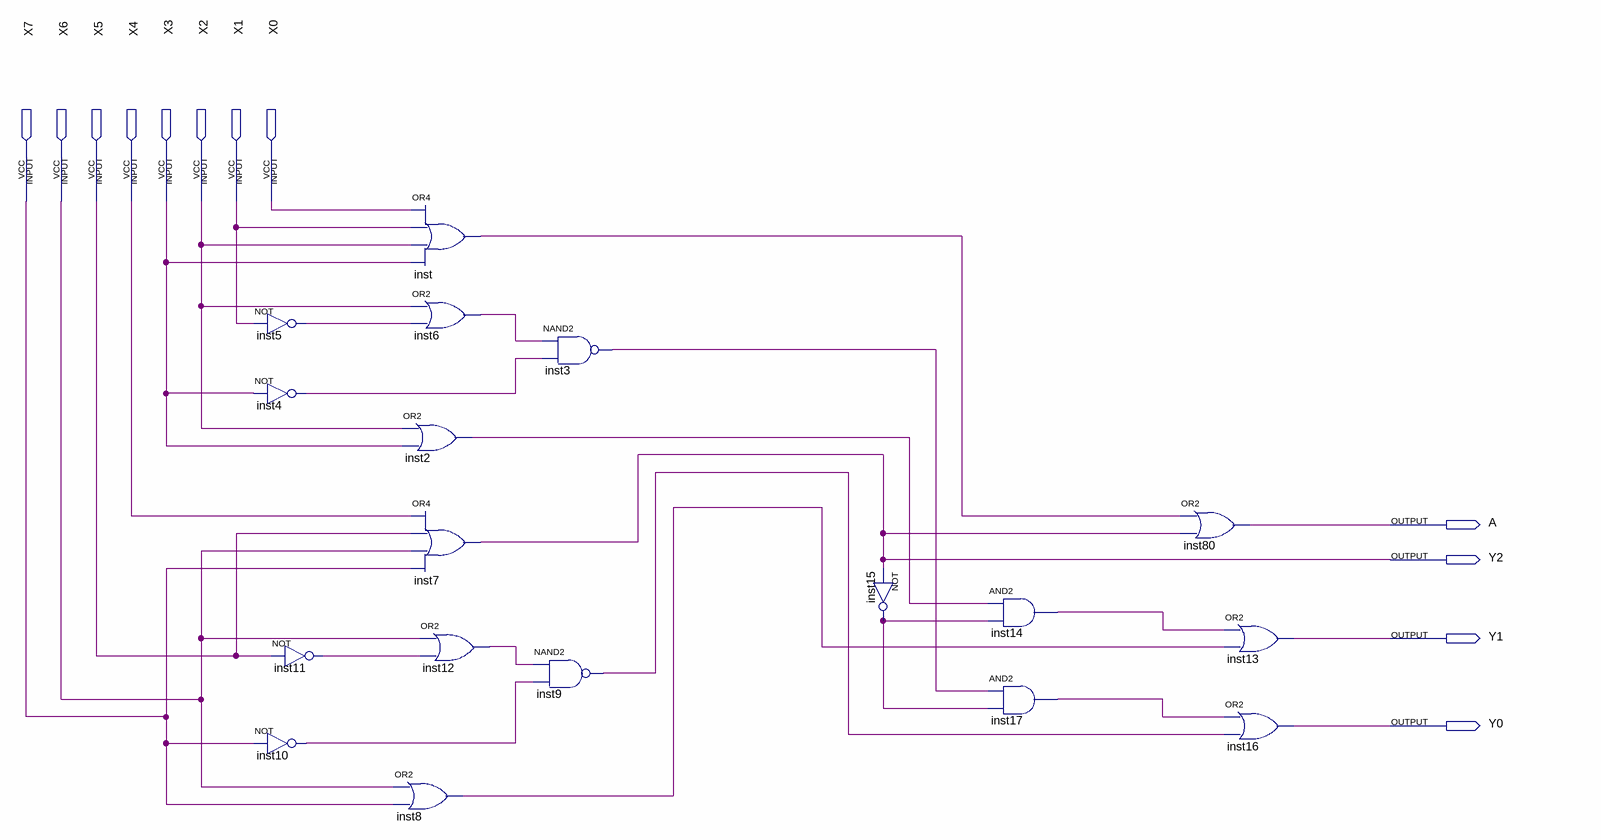
[diagram p0: schematic sheet]
// Quartus schematic q51.bdf as structural Verilog: 18 symbols, 12 pins
module q51 (
  input  X7,
  input  X6,
  input  X5,
  input  X4,
  input  X3,
  input  X2,
  input  X1,
  input  X0,
  output A,
  output Y2,
  output Y1,
  output Y0
);

  wire inst2_out, inst3_out, inst4_out, inst5_out, inst6_out, inst8_out, inst9_out, inst10_out, inst11_out,
       inst12_out, inst14_out, inst15_out, inst17_out, inst_out;

  not inst5 (inst5_out, X1);
  not inst4 (inst4_out, X3);
  not inst11 (inst11_out, X5);
  not inst10 (inst10_out, X7);
  or inst (inst_out, X0, X1, X2, X3);
  or inst6 (inst6_out, X2, inst5_out);
  or inst2 (inst2_out, X2, X3);
  or inst7 (Y2, X4, X5, X6, X7);
  or inst12 (inst12_out, X6, inst11_out);
  or inst8 (inst8_out, X6, X7);
  nand inst3 (inst3_out, inst6_out, inst4_out);
  nand inst9 (inst9_out, inst12_out, inst10_out);
  not inst15 (inst15_out, Y2);
  and inst14 (inst14_out, inst2_out, inst15_out);
  and inst17 (inst17_out, inst3_out, inst15_out);
  or inst80 (A, inst_out, Y2);
  or inst13 (Y1, inst14_out, inst8_out);
  or inst16 (Y0, inst17_out, inst9_out);
endmodule
